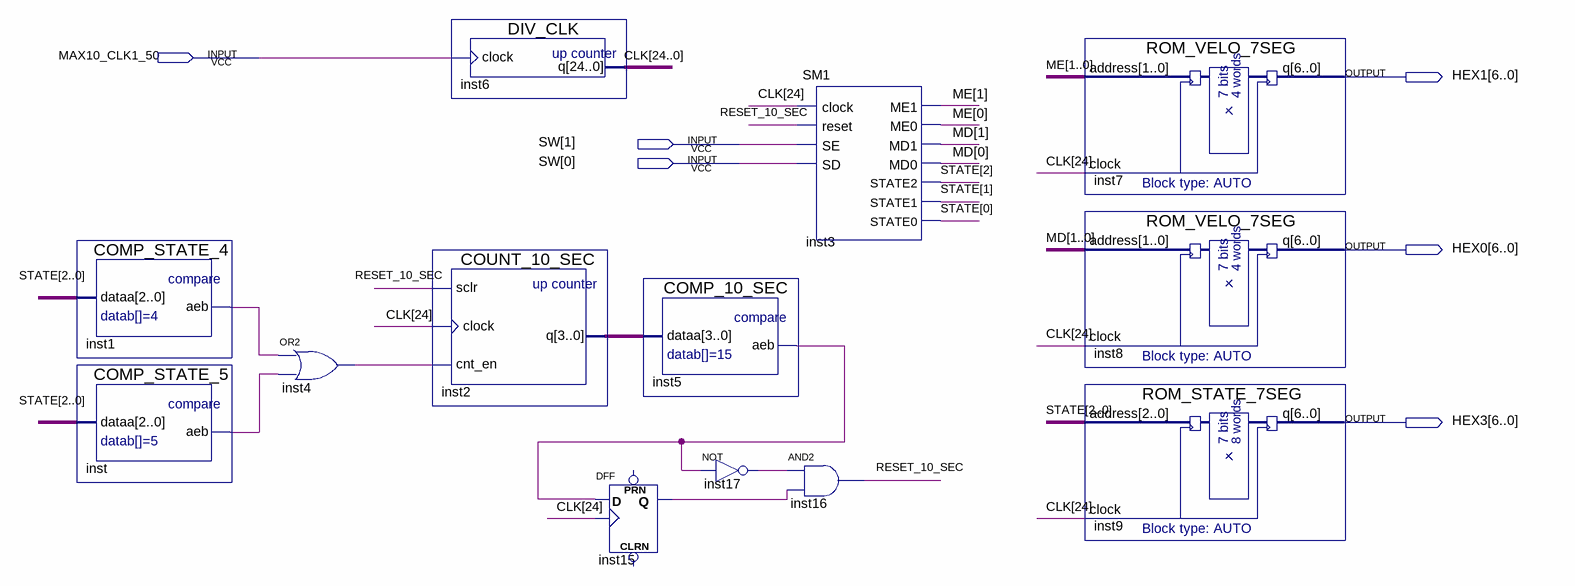
[diagram p0: schematic sheet]
// Quartus schematic Line_Robot_2.bdf as structural Verilog: 13 symbols, 6 pins
module Line_Robot_2 (
  input  MAX10_CLK1_50,
  input  [1:0] SW,
  output [6:0] HEX1,
  output [6:0] HEX0,
  output [6:0] HEX3
);

  wire inst1_aeb, inst4_out, inst5_aeb, inst15_q, inst17_out, inst_aeb, RESET_10_SEC;
  wire [1:0] MD, ME;
  wire [2:0] STATE;
  wire [3:0] inst2_q;
  wire [24:0] CLK;

  COMP_STATE_4 inst1 (.dataa(STATE), .aeb(inst1_aeb));
  COMP_STATE_5 inst (.dataa(STATE), .aeb(inst_aeb));
  or inst4 (inst4_out, inst1_aeb, inst_aeb);
  DIV_CLK inst6 (.clock(MAX10_CLK1_50), .q(CLK));
  COUNT_10_SEC inst2 (.sclr(RESET_10_SEC), .clock(CLK[24]), .cnt_en(inst4_out), .q(inst2_q));
  DFF inst15 (.CLK(CLK[24]), .D(inst5_aeb), .Q(inst15_q));  // open: CLRN, PRN
  COMP_10_SEC inst5 (.dataa(inst2_q), .aeb(inst5_aeb));
  not inst17 (inst17_out, inst5_aeb);
  SM1 inst3 (
    .clock(CLK[24]), .reset(RESET_10_SEC), .SE(SW[1]), .SD(SW[0]), .ME1(ME[1]), .ME0(ME[0]), .MD1(MD[1]),
    .MD0(MD[0]), .STATE2(STATE[2]), .STATE1(STATE[1]), .STATE0(STATE[0]));
  and inst16 (RESET_10_SEC, inst17_out, inst15_q);
  ROM_VELO_7SEG inst7 (.address(ME), .clock(CLK[24]), .q(HEX1));
  ROM_VELO_7SEG inst8 (.address(MD), .clock(CLK[24]), .q(HEX0));
  ROM_STATE_7SEG inst9 (.address(STATE), .clock(CLK[24]), .q(HEX3));
endmodule
